# Altium schematic sheet DHT11.SchDoc
size A; SheetNumber: 4; SheetTotal: 9
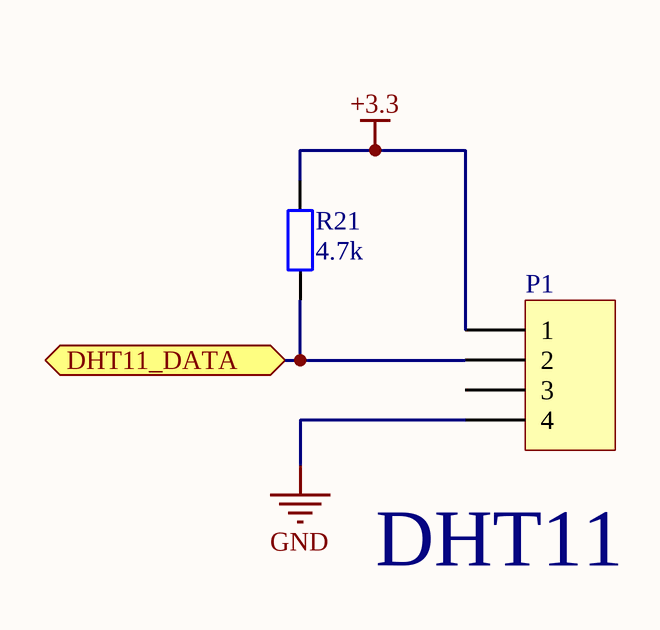
[diagram p0: DHT11.SchDoc]

## Parts
P1  DHT11  [HDR1X4H]
R21  4.7k  [tro smd 0603]

## Ports
DHT11_DATA (bidir)

## Nets
+3.3: P1.1 R21.2
GND: P1.4
DHT11_DATA: P1.2 R21.1 ; port DHT11_DATA

Not connected (* = marked no-connect by the designer): P1 3

## Library data of the parts
P1 = Header 4H: Header, 4-Pin, Right Angle; LatestRevisionDate: 17-Jul-2002; LatestRevisionNote: Re-released for DXP Platform.; Publisher: Altium Limited
R21 = Tro 0603 5% 4.7k: Dán; Don_Vi: Con; So_Chan: 2; Ten_Linh_Kien: Trở 0603 5% 4.7k; Ma_Hang: MH006327; Chung_Loai: Dán; Kieu_Chan: *